# Altium project UNIREL-POT.PrjPcb
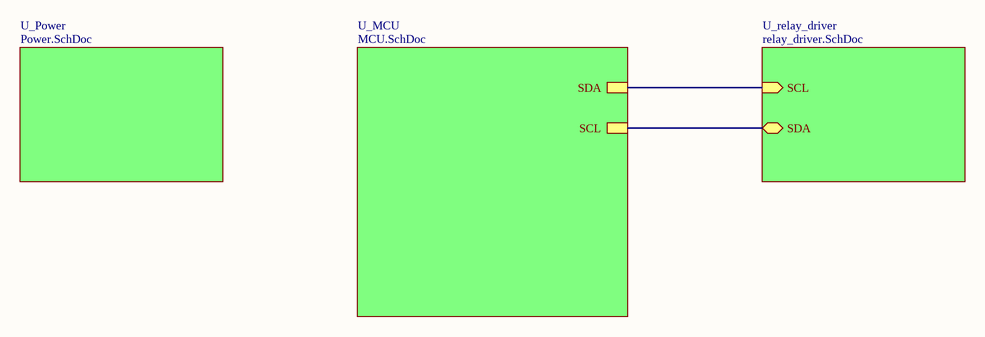
[diagram p0: overview.SchDoc]
5 sheets, 326 parts. Net scope: hierarchical (ports join the sheet entries above them; power ports are global).
Board files: PCB1.PcbDoc, PCB2.PcbDoc, PCB3.PcbDoc
Sheets:
  overview.SchDoc
    U_MCU = MCU.SchDoc
    U_Power = Power.SchDoc
    U_relay_driver = relay_driver.SchDoc
      U_relay_ladder = relay_ladder.SchDoc
      U_relay_ladder = relay_ladder.SchDoc
      U_relay_ladder = relay_ladder.SchDoc
      U_relay_ladder = relay_ladder.SchDoc
      U_relay_ladder = relay_ladder.SchDoc
      U_relay_ladder = relay_ladder.SchDoc
      U_relay_ladder = relay_ladder.SchDoc
      U_relay_ladder = relay_ladder.SchDoc
      U_relay_ladder = relay_ladder.SchDoc
      U_relay_ladder = relay_ladder.SchDoc

## Sheet overview.SchDoc
size A4

### Sub-sheets
U_MCU = MCU.SchDoc: SDA, SCL
U_Power = Power.SchDoc: no entries
U_relay_driver = relay_driver.SchDoc: SCL (in), SDA (bidir)

### Nets
SCL_DRV: sheet U_MCU/SDA, sheet U_relay_driver/SCL
SDA_DRV: sheet U_MCU/SCL, sheet U_relay_driver/SDA

## Sheet MCU.SchDoc
size A4
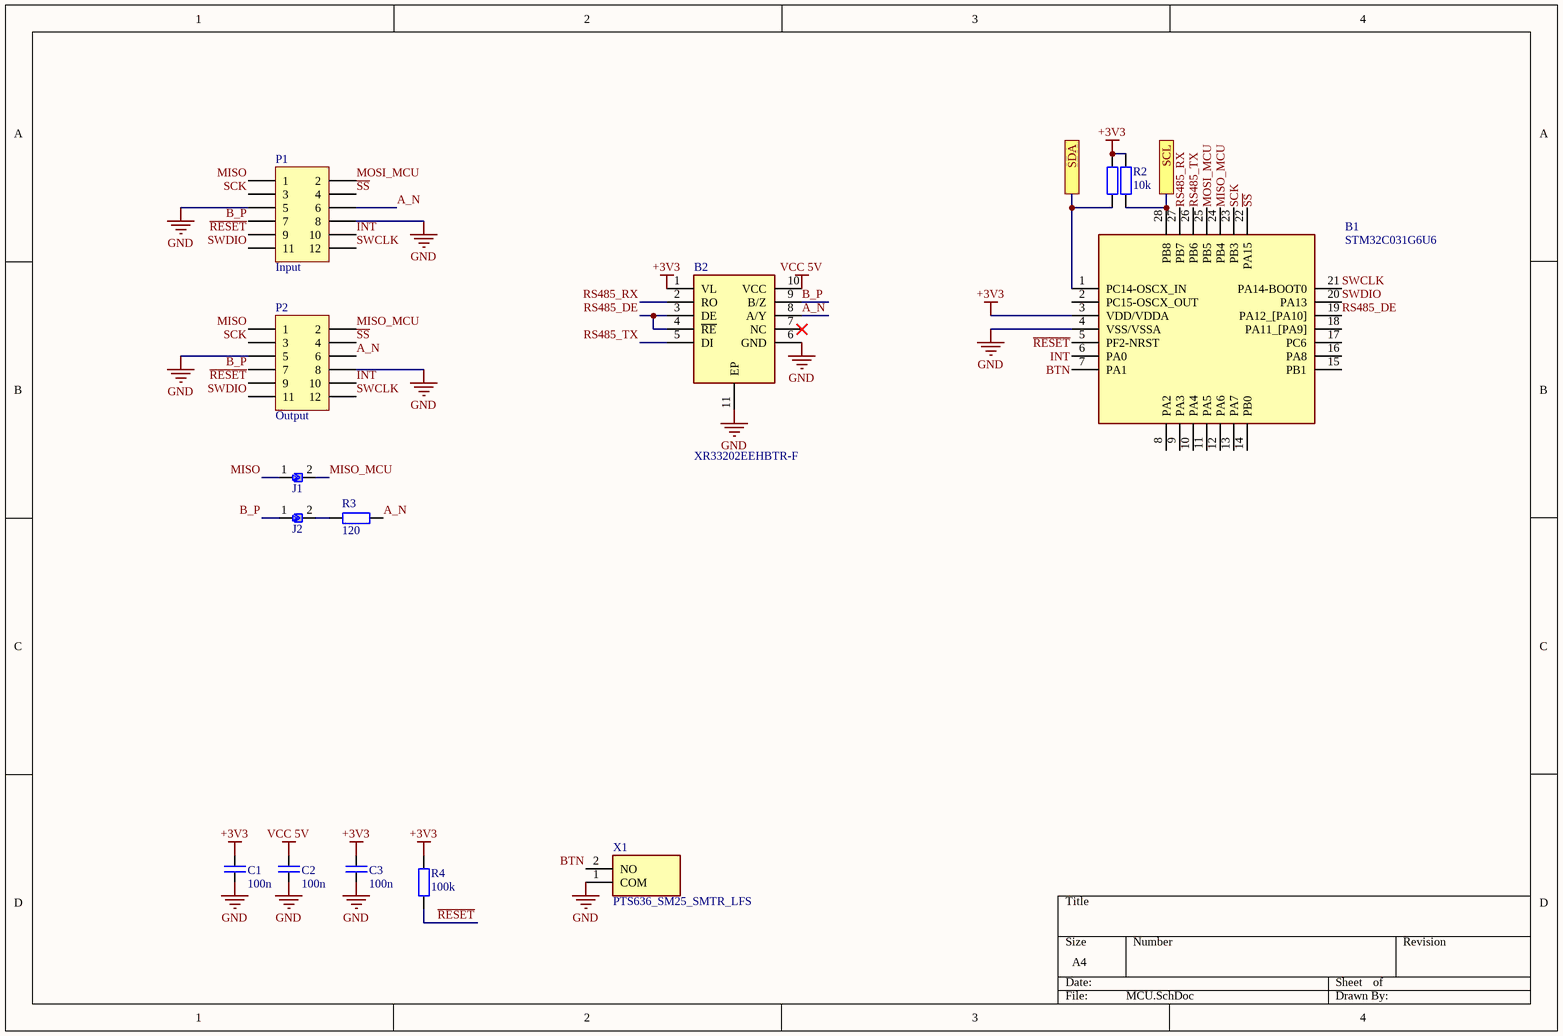
[diagram p1: MCU.SchDoc]

### Parts
B1  STM32C031G6U6  [QFN50P400X400X60-28N-D]
B2  XR33202EEHBTR-F  [SON50P300X300X80-11N-D]
C1  100n  [R1005_0402i_L]
C2  100n  [R1005_0402i_L]
C3  100n  [R1005_0402i_L]
J1  solder_jumper  [solder_jumper_triangle]  (value not drawn)
J2  solder_jumper  [solder_jumper_triangle]  (value not drawn)
P1  Input  [1.27mm SMD conn]
P2  Output  [1.27mm SMD conn]
R1  10k  [R1005_0402i_L]  (value not drawn)
R2  10k  [R1005_0402i_L]
R3  120  [R1005_0402i_L]
R4  100k  [R1005_0402i_L]
X1  PTS636_SM25_SMTR_LFS  [PTS636SM25SMTRLFS]

### Ports
SCL, SDA

### Nets
+3V3: B1.3(VDD/VDDA) B2.1(VL) C1.1 C3.1 R1.1 R2.1 R4.1
GND: B1.4(VSS/VSSA) B2.6(GND) B2.11(EP) C1.2 C2.2 C3.2 P1.5 P1.8 P2.5 P2.8 X1.1(COM)
VCC 5V: B2.10(VCC) C2.1
A_N: B2.8(A/Y) P1.6 P2.6 R3.2
B_P: B2.9(B/Z) J2.1 P1.7 P2.7
BTN: B1.7(PA1) X1.2(NO)
INT: B1.6(PA0) P1.10 P2.10
MISO: J1.1 P1.1 P2.1
MISO_MCU: B1.24(PB4) J1.2 P2.2
MOSI_MCU: B1.25(PB5) P1.2
~{RESET}: B1.5(PF2-NRST) P1.9 P2.9 R4.2
RS485_DE: B1.19(PA12_[PA10]) B2.3(DE) B2.4(~{RE})
RS485_RX: B1.27(PB7) B2.2(RO)
RS485_TX: B1.26(PB6) B2.5(DI)
~{SS}: B1.22(PA15) P1.4 P2.4
SCK: B1.23(PB3) P1.3 P2.3
SCL_DRV: B1.1(PC14-OSCX_IN) R1.2 ; port SDA
SDA_DRV: B1.28(PB8) R2.2 ; port SCL
SWCLK: B1.21(PA14-BOOT0) P1.12 P2.12
SWDIO: B1.20(PA13) P1.11 P2.11
NetJ2_2: J2.2 R3.1

Not connected (* = marked no-connect by the designer): B1 2(PC15-OSCX_OUT) 8(PA2) 9(PA3) 10(PA4) 11(PA5) 12(PA6) 13(PA7) 14(PB0) 15(PB1) 16(PA8) 17(PC6) 18(PA11_[PA9]); B2 7(NC)*

### Library data of the parts
B1 = STM32C031G6U6: Mainstream Arm Cortex-M0+ MCU with 32 Kbytes of Flash memory, 12 Kbytes RAM, 48 MHz CPU, 2x USART, timers, ADC, comm. I/F, 2-3.6V; Manufacturer_Name: STMicroelectronics; Geometry.Height: 0.6mm; Mouser Part Number: 511-STM32C031G6U6; Mouser Price/Stock: https://www.mouser.co.uk/ProductDetail/STMicroelectronics/STM32C031G6U6?qs=IPgv5n7u5QZqRf3nOTChhw%3D%3D; Manufacturer_Part_Number: STM32C031G6U6; Datasheet Link: https://www.st.com/resource/en/datasheet/stm32c031c4.pdf
B2 = XR33202EEHBTR-F: RS-422/RS-485 Interface IC Wide Supply Trans with I/O Interface; Manufacturer_Name: MaxLinear, Inc.; Geometry.Height: 0.8mm; Mouser Part Number: 701-XR33202EEHBTR-F; Mouser Price/Stock: https://www.mouser.co.uk/ProductDetail/MaxLinear/XR33202EEHBTR-F?qs=GtWAI9k6EVi4nRW8bj1LFw%3D%3D; Manufacturer_Part_Number: XR33202EEHBTR-F; Datasheet Link: https://www.maxlinear.com/ds/xr33202.pdf
C1-C3 = C: Capacitor
P1 P2 = Header 6X2: Header, 6-Pin, Dual row; LatestRevisionDate: 17-Jul-2002; LatestRevisionNote: Re-released for DXP Platform.; Publisher: Altium Limited
R1-R4 = R
X1 = PTS636_SM25_SMTR_LFS: Tactile Switches Tact 50mA 12VDC, 6.0x3.5, 2.5mm H, 180gf, G leads, No ground pin, White Actuator; Manufacturer_Name: C & K COMPONENTS; Manufacturer_Part_Number: PTS636 SM25 SMTR LFS; Geometry.Height: 2.7mm; Mouser Part Number: 611-PTS636SM25SMTRLF; Mouser Price/Stock: https://www.mouser.co.uk/ProductDetail/CK/PTS636-SM25-SMTR-LFS?qs=vLWxofP3U2yIXR4iooxesw%3D%3D; Datasheet Link: https://componentsearchengine.com/Datasheets/1/PTS636 SM25 SMTR LFS.pdf

## Sheet Power.SchDoc
size A4
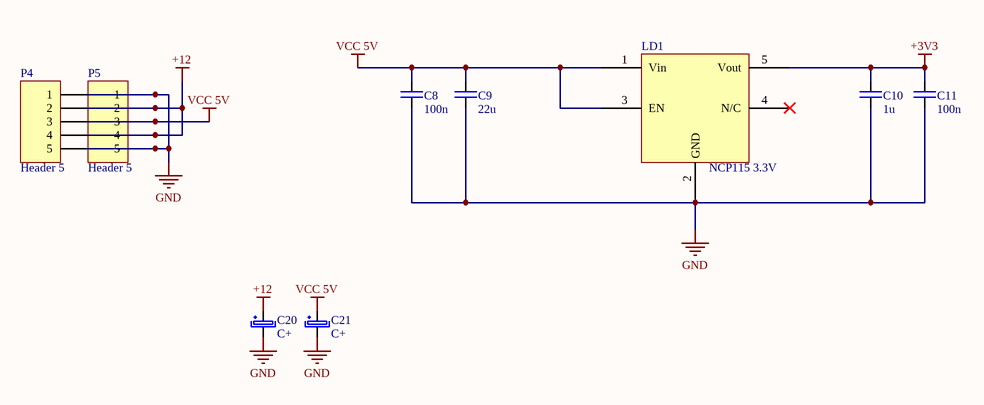
[diagram p2: Power.SchDoc]

### Parts
C8  100n  [R1005_0402i_L]
C9  22u  [C1608_0603I_L]
C10  1u  [R1005_0402i_L]
C11  100n  [R1005_0402i_L]
C20  C+  [C AlElko 5x11 R2]
C21  C+  [C AlElko 5x11 R2]
LD1  NCP115 3.3V  [TSOP95P280X110-6L]
P4  Header 5  [HDR1X5]
P5  Header 5  [HDR1X5]

### Nets
+3V3: C10.1 C11.1 LD1.5(Vout)
+12: C20.1 P4.2 P4.4 P5.2 P5.4
GND: C8.2 C9.2 C10.2 C11.2 C20.2 C21.2 LD1.2(GND) P4.1 P4.5 P5.1 P5.5
VCC 5V: C8.1 C9.1 C21.1 LD1.1(Vin) LD1.3(EN) P4.3 P5.3

Not connected (* = marked no-connect by the designer): LD1 4(N/C)*

### Library data of the parts
C8-C11 = C: Capacitor
C20 C21 = C+: Capacitor Polarized
P4 P5 = Header 5: Header, 5-Pin; LatestRevisionDate: 17-Jul-2002; LatestRevisionNote: Re-released for DXP Platform.; Publisher: Altium Limited

## Sheet relay_driver.SchDoc
size A2
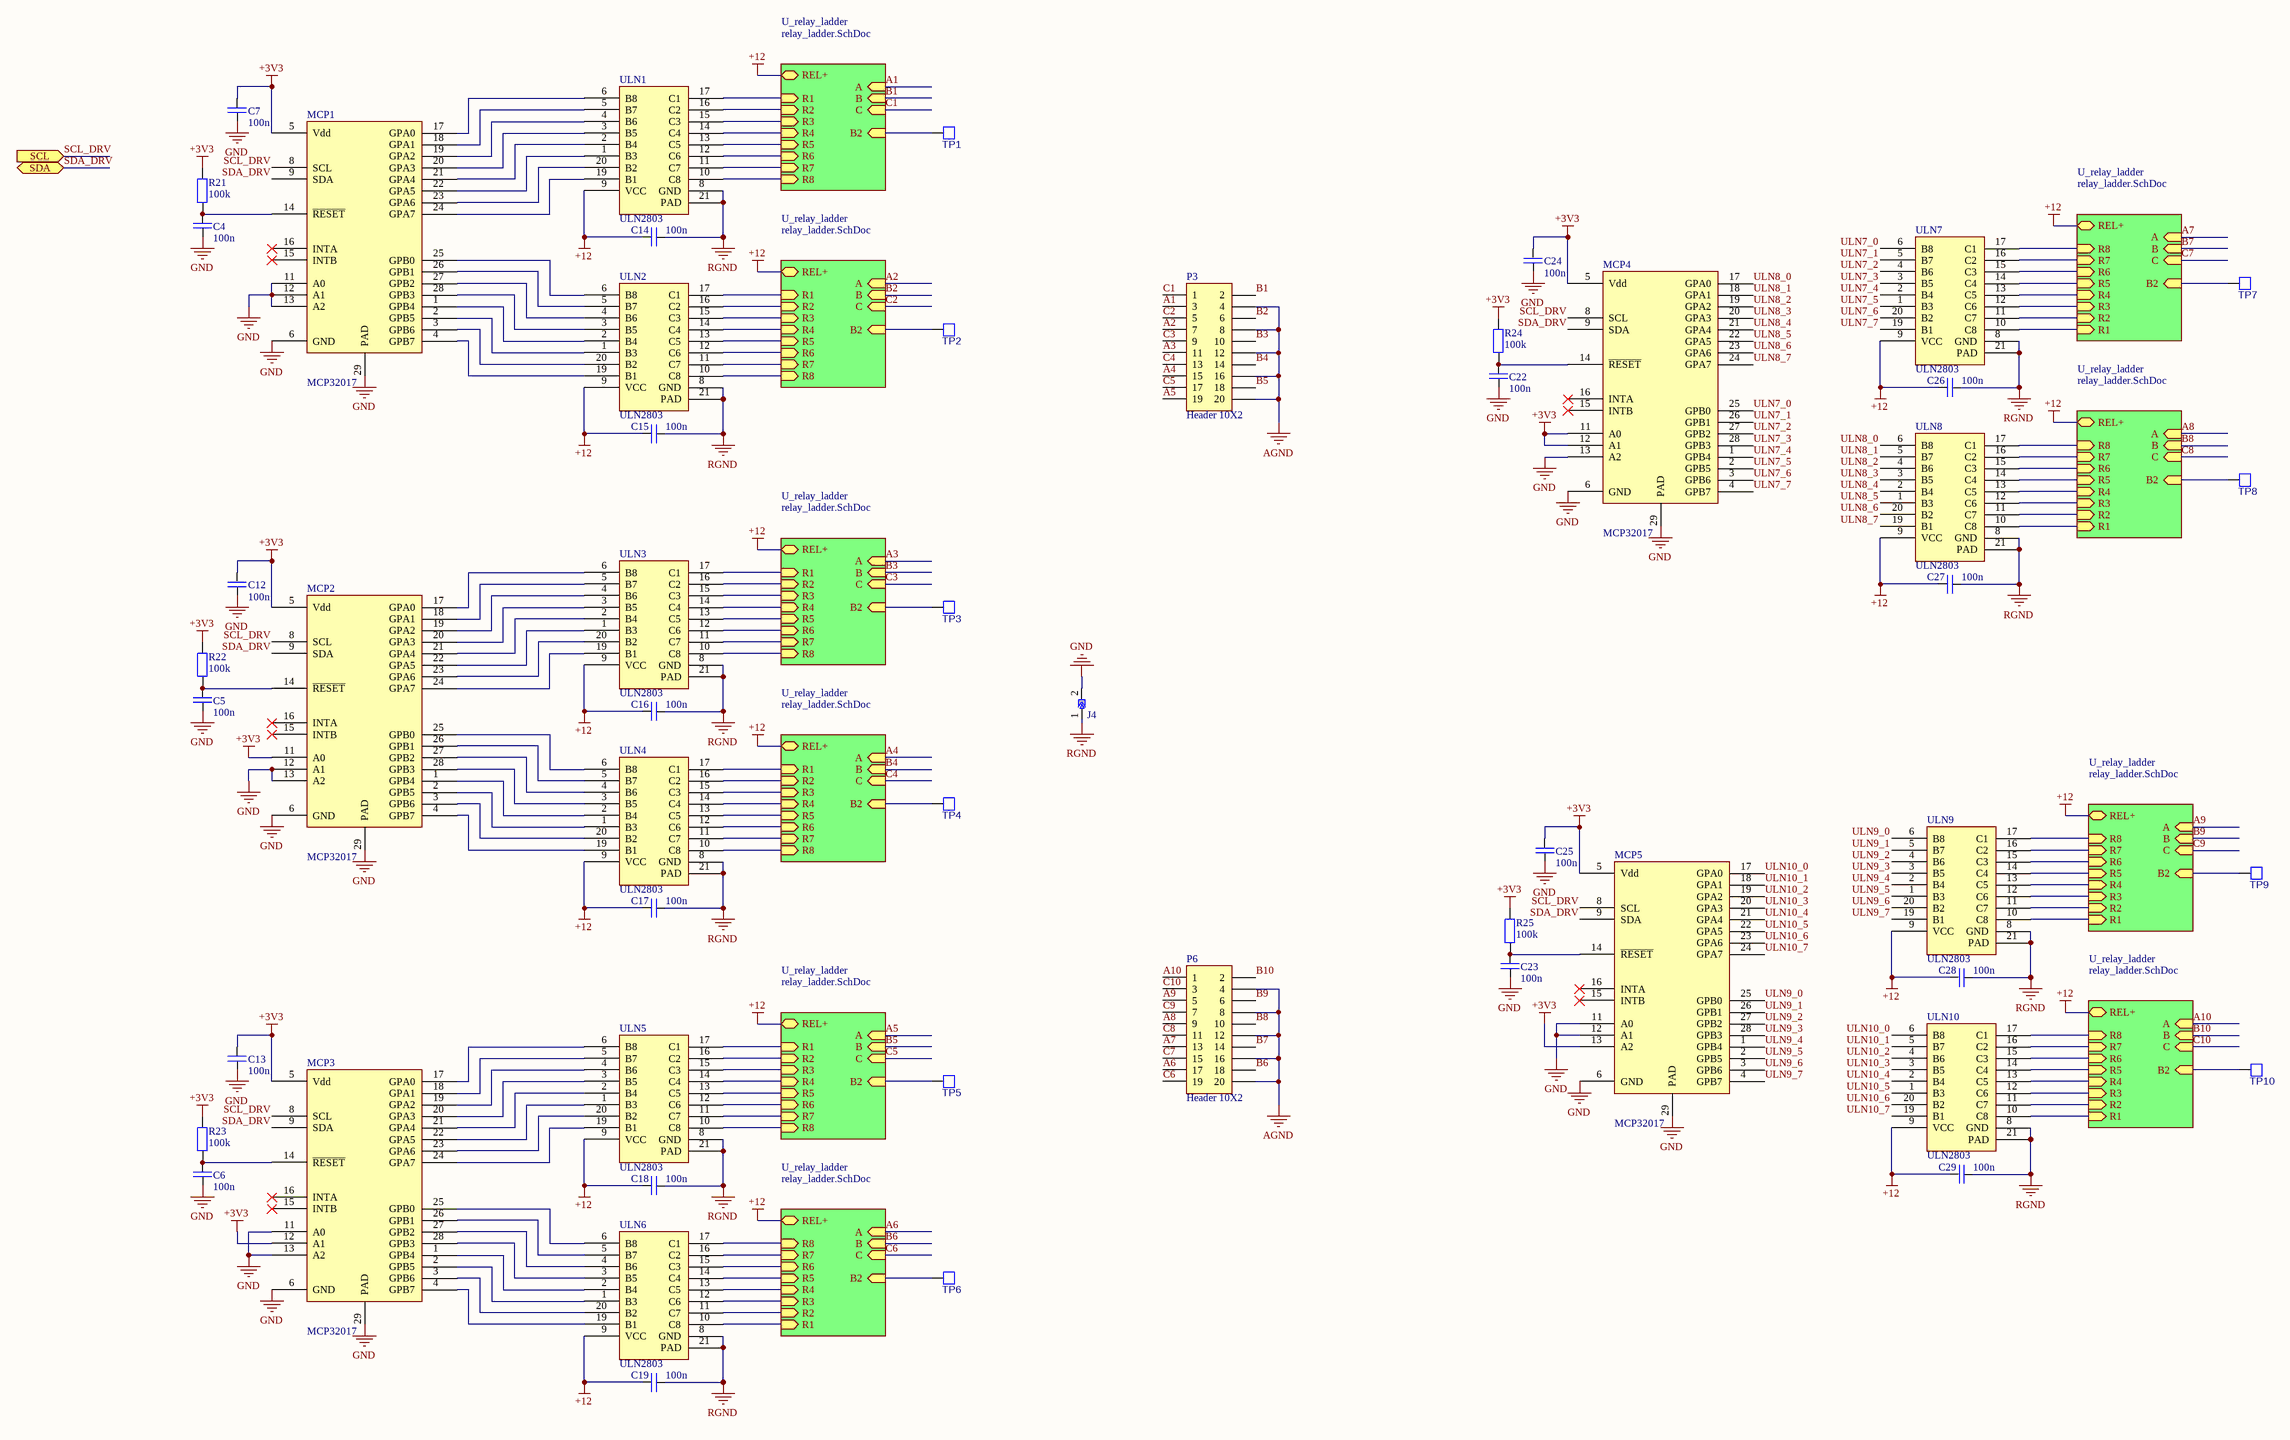
[diagram p3: relay_driver.SchDoc]

### Parts
C4  100n  [R1005_0402i_L]
C5  100n  [R1005_0402i_L]
C6  100n  [R1005_0402i_L]
C7  100n  [R1005_0402i_L]
C12  100n  [R1005_0402i_L]
C13  100n  [R1005_0402i_L]
C14  100n  [R1005_0402i_L]
C15  100n  [R1005_0402i_L]
C16  100n  [R1005_0402i_L]
C17  100n  [R1005_0402i_L]
C18  100n  [R1005_0402i_L]
C19  100n  [R1005_0402i_L]
C22  100n  [R1005_0402i_L]
C23  100n  [R1005_0402i_L]
C24  100n  [R1005_0402i_L]
C25  100n  [R1005_0402i_L]
C26  100n  [R1005_0402i_L]
C27  100n  [R1005_0402i_L]
C28  100n  [R1005_0402i_L]
C29  100n  [R1005_0402i_L]
J4  solder_jumper  [solder_jumper_triangle]  (value not drawn)
MCP1  MCP32017  [MCP23017 QFN]
MCP2  MCP32017  [MCP23017 QFN]
MCP3  MCP32017  [MCP23017 QFN]
MCP4  MCP32017  [MCP23017 QFN]
MCP5  MCP32017  [MCP23017 QFN]
P3  Header 10X2  [HDR2X10]
P6  Header 10X2  [HDR2X10]
R21  100k  [R1005_0402i_L]
R22  100k  [R1005_0402i_L]
R23  100k  [R1005_0402i_L]
R24  100k  [R1005_0402i_L]
R25  100k  [R1005_0402i_L]
TP1  PAD  [PAD_CIRC_HOLE]  (value not drawn)
TP2  PAD  [PAD_CIRC_HOLE]  (value not drawn)
TP3  PAD  [PAD_CIRC_HOLE]  (value not drawn)
TP4  PAD  [PAD_CIRC_HOLE]  (value not drawn)
TP5  PAD  [PAD_CIRC_HOLE]  (value not drawn)
TP6  PAD  [PAD_CIRC_HOLE]  (value not drawn)
TP7  PAD  [PAD_CIRC_HOLE]  (value not drawn)
TP8  PAD  [PAD_CIRC_HOLE]  (value not drawn)
TP9  PAD  [PAD_CIRC_HOLE]  (value not drawn)
TP10  PAD  [PAD_CIRC_HOLE]  (value not drawn)
ULN1  ULN2803  [QFN127P600-8N]
ULN2  ULN2803  [QFN127P600-8N]
ULN3  ULN2803  [QFN127P600-8N]
ULN4  ULN2803  [QFN127P600-8N]
ULN5  ULN2803  [QFN127P600-8N]
ULN6  ULN2803  [QFN127P600-8N]
ULN7  ULN2803  [QFN127P600-8N]
ULN8  ULN2803  [QFN127P600-8N]
ULN9  ULN2803  [QFN127P600-8N]
ULN10  ULN2803  [QFN127P600-8N]

### Sub-sheets
U_relay_ladder = relay_ladder.SchDoc: B (in), C (in), A (in), REL+ (bidir), R1 (in), R2 (in), R3 (in), R4 (in), R5 (in), R6 (in), R7 (in), R8 (in), B2 (in)
U_relay_ladder = relay_ladder.SchDoc: B (in), C (in), A (in), REL+ (bidir), R1 (in), R2 (in), R3 (in), R4 (in), R5 (in), R6 (in), R7 (in), R8 (in), B2 (in)
U_relay_ladder = relay_ladder.SchDoc: B (in), C (in), A (in), REL+ (bidir), R1 (in), R2 (in), R3 (in), R4 (in), R5 (in), R6 (in), R7 (in), R8 (in), B2 (in)
U_relay_ladder = relay_ladder.SchDoc: B (in), C (in), A (in), REL+ (bidir), R1 (in), R2 (in), R3 (in), R4 (in), R5 (in), R6 (in), R7 (in), R8 (in), B2 (in)
U_relay_ladder = relay_ladder.SchDoc: B (in), C (in), A (in), REL+ (bidir), R1 (in), R2 (in), R3 (in), R4 (in), R5 (in), R6 (in), R7 (in), R8 (in), B2 (in)
U_relay_ladder = relay_ladder.SchDoc: B (in), C (in), A (in), REL+ (bidir), R1 (in), R2 (in), R3 (in), R4 (in), R5 (in), R6 (in), R7 (in), R8 (in), B2 (in)
U_relay_ladder = relay_ladder.SchDoc: B (in), C (in), A (in), REL+ (bidir), R1 (in), R2 (in), R3 (in), R4 (in), R5 (in), R6 (in), R7 (in), R8 (in), B2 (in)
U_relay_ladder = relay_ladder.SchDoc: B (in), C (in), A (in), REL+ (bidir), R1 (in), R2 (in), R3 (in), R4 (in), R5 (in), R6 (in), R7 (in), R8 (in), B2 (in)
U_relay_ladder = relay_ladder.SchDoc: B (in), C (in), A (in), REL+ (bidir), R1 (in), R2 (in), R3 (in), R4 (in), R5 (in), R6 (in), R7 (in), R8 (in), B2 (in)
U_relay_ladder = relay_ladder.SchDoc: B (in), C (in), A (in), REL+ (bidir), R1 (in), R2 (in), R3 (in), R4 (in), R5 (in), R6 (in), R7 (in), R8 (in), B2 (in)

### Ports
SCL (in), SDA (bidir)

### Nets
+3V3: C7.2 C12.2 C13.2 C24.2 C25.2 MCP1.5(Vdd) MCP2.5(Vdd) MCP2.11(A0) MCP3.5(Vdd) MCP3.12(A1) MCP4.5(Vdd) MCP4.11(A0) MCP4.12(A1) MCP5.5(Vdd) MCP5.13(A2) R21.1 R22.1 R23.1 R24.1 R25.1
+12: C14.1 C15.1 C16.1 C17.1 C18.1 C19.1 C26.1 C27.1 C28.1 C29.1 ULN1.9(VCC) ULN2.9(VCC) ULN3.9(VCC) ULN4.9(VCC) ULN5.9(VCC) ULN6.9(VCC) ULN7.9(VCC) ULN8.9(VCC) ULN9.9(VCC) ULN10.9(VCC) ; sheet U_relay_ladder/REL+, sheet U_relay_ladder/REL+, sheet U_relay_ladder/REL+, sheet U_relay_ladder/REL+, sheet U_relay_ladder/REL+, sheet U_relay_ladder/REL+, sheet U_relay_ladder/REL+, sheet U_relay_ladder/REL+, sheet U_relay_ladder/REL+, sheet U_relay_ladder/REL+
AGND: P3.4 P3.8 P3.12 P3.16 P3.20 P6.4 P6.8 P6.12 P6.16 P6.20
GND: C4.1 C5.1 C6.1 C7.1 C12.1 C13.1 C22.1 C23.1 C24.1 C25.1 J4.2 MCP1.6(GND) MCP1.11(A0) MCP1.12(A1) MCP1.13(A2) MCP1.29(PAD) MCP2.6(GND) MCP2.12(A1) MCP2.13(A2) MCP2.29(PAD) MCP3.6(GND) MCP3.11(A0) MCP3.13(A2) MCP3.29(PAD) MCP4.6(GND) MCP4.13(A2) MCP4.29(PAD) MCP5.6(GND) MCP5.11(A0) MCP5.12(A1) MCP5.29(PAD)
RGND: C14.2 C15.2 C16.2 C17.2 C18.2 C19.2 C26.2 C27.2 C28.2 C29.2 J4.1 ULN1.8(GND) ULN1.21(PAD) ULN2.8(GND) ULN2.21(PAD) ULN3.8(GND) ULN3.21(PAD) ULN4.8(GND) ULN4.21(PAD) ULN5.8(GND) ULN5.21(PAD) ULN6.8(GND) ULN6.21(PAD) ULN7.8(GND) ULN7.21(PAD) ULN8.8(GND) ULN8.21(PAD) ULN9.8(GND) ULN9.21(PAD) ULN10.8(GND) ULN10.21(PAD)
A1: P3.3 ; sheet U_relay_ladder/A
A2: P3.7 ; sheet U_relay_ladder/A
A3: P3.11 ; sheet U_relay_ladder/A
A4: P3.15 ; sheet U_relay_ladder/A
A5: P3.19 ; sheet U_relay_ladder/A
A6: P6.17 ; sheet U_relay_ladder/A
A7: P6.13 ; sheet U_relay_ladder/A
A8: P6.9 ; sheet U_relay_ladder/A
A9: P6.5 ; sheet U_relay_ladder/A
A10: P6.1 ; sheet U_relay_ladder/A
B1: P3.2 TP1.1 ; sheet U_relay_ladder/B, sheet U_relay_ladder/B2
B2: P3.6 TP2.1 ; sheet U_relay_ladder/B, sheet U_relay_ladder/B2
B3: P3.10 TP3.1 ; sheet U_relay_ladder/B, sheet U_relay_ladder/B2
B4: P3.14 TP4.1 ; sheet U_relay_ladder/B, sheet U_relay_ladder/B2
B5: P3.18 TP5.1 ; sheet U_relay_ladder/B, sheet U_relay_ladder/B2
B6: P6.18 TP6.1 ; sheet U_relay_ladder/B, sheet U_relay_ladder/B2
B7: P6.14 TP7.1 ; sheet U_relay_ladder/B, sheet U_relay_ladder/B2
B8: P6.10 TP8.1 ; sheet U_relay_ladder/B, sheet U_relay_ladder/B2
B9: P6.6 TP9.1 ; sheet U_relay_ladder/B, sheet U_relay_ladder/B2
B10: P6.2 TP10.1 ; sheet U_relay_ladder/B, sheet U_relay_ladder/B2
C1: P3.1 ; sheet U_relay_ladder/C
C2: P3.5 ; sheet U_relay_ladder/C
C3: P3.9 ; sheet U_relay_ladder/C
C4: P3.13 ; sheet U_relay_ladder/C
C5: P3.17 ; sheet U_relay_ladder/C
C6: P6.19 ; sheet U_relay_ladder/C
C7: P6.15 ; sheet U_relay_ladder/C
C8: P6.11 ; sheet U_relay_ladder/C
C9: P6.7 ; sheet U_relay_ladder/C
C10: P6.3 ; sheet U_relay_ladder/C
SCL_DRV: MCP1.8(SCL) MCP2.8(SCL) MCP3.8(SCL) MCP4.8(SCL) MCP5.8(SCL) ; port SCL
SDA_DRV: MCP1.9(SDA) MCP2.9(SDA) MCP3.9(SDA) MCP4.9(SDA) MCP5.9(SDA) ; port SDA
ULN7_0: MCP4.25(GPB0) ULN7.6(B8)
ULN7_1: MCP4.26(GPB1) ULN7.5(B7)
ULN7_2: MCP4.27(GPB2) ULN7.4(B6)
ULN7_3: MCP4.28(GPB3) ULN7.3(B5)
ULN7_4: MCP4.1(GPB4) ULN7.2(B4)
ULN7_5: MCP4.2(GPB5) ULN7.1(B3)
ULN7_6: MCP4.3(GPB6) ULN7.20(B2)
ULN7_7: MCP4.4(GPB7) ULN7.19(B1)
ULN8_0: MCP4.17(GPA0) ULN8.6(B8)
ULN8_1: MCP4.18(GPA1) ULN8.5(B7)
ULN8_2: MCP4.19(GPA2) ULN8.4(B6)
ULN8_3: MCP4.20(GPA3) ULN8.3(B5)
ULN8_4: MCP4.21(GPA4) ULN8.2(B4)
ULN8_5: MCP4.22(GPA5) ULN8.1(B3)
ULN8_6: MCP4.23(GPA6) ULN8.20(B2)
ULN8_7: MCP4.24(GPA7) ULN8.19(B1)
ULN9_0: MCP5.25(GPB0) ULN9.6(B8)
ULN9_1: MCP5.26(GPB1) ULN9.5(B7)
ULN9_2: MCP5.27(GPB2) ULN9.4(B6)
ULN9_3: MCP5.28(GPB3) ULN9.3(B5)
ULN9_4: MCP5.1(GPB4) ULN9.2(B4)
ULN9_5: MCP5.2(GPB5) ULN9.1(B3)
ULN9_6: MCP5.3(GPB6) ULN9.20(B2)
ULN9_7: MCP5.4(GPB7) ULN9.19(B1)
ULN10_0: MCP5.17(GPA0) ULN10.6(B8)
ULN10_1: MCP5.18(GPA1) ULN10.5(B7)
ULN10_2: MCP5.19(GPA2) ULN10.4(B6)
ULN10_3: MCP5.20(GPA3) ULN10.3(B5)
ULN10_4: MCP5.21(GPA4) ULN10.2(B4)
ULN10_5: MCP5.22(GPA5) ULN10.1(B3)
ULN10_6: MCP5.23(GPA6) ULN10.20(B2)
ULN10_7: MCP5.24(GPA7) ULN10.19(B1)
NetC4_2: C4.2 MCP1.14(~{RESET}) R21.2
NetC5_2: C5.2 MCP2.14(~{RESET}) R22.2
NetC6_2: C6.2 MCP3.14(~{RESET}) R23.2
NetC22_2: C22.2 MCP4.14(~{RESET}) R24.2
NetC23_2: C23.2 MCP5.14(~{RESET}) R25.2
NetK1_U_relay_ladder1_8: ULN10.17(C1) ; sheet U_relay_ladder/R8
NetK1_U_relay_ladder2_8: ULN9.17(C1) ; sheet U_relay_ladder/R8
NetK1_U_relay_ladder3_8: ULN8.17(C1) ; sheet U_relay_ladder/R8
NetK1_U_relay_ladder4_8: ULN7.17(C1) ; sheet U_relay_ladder/R8
NetK1_U_relay_ladder5_8: ULN6.17(C1) ; sheet U_relay_ladder/R8
NetK1_U_relay_ladder6_8: ULN5.10(C8) ; sheet U_relay_ladder/R8
NetK1_U_relay_ladder7_8: ULN4.10(C8) ; sheet U_relay_ladder/R8
NetK1_U_relay_ladder8_8: ULN3.10(C8) ; sheet U_relay_ladder/R8
NetK1_U_relay_ladder9_8: ULN2.10(C8) ; sheet U_relay_ladder/R8
NetK1_U_relay_ladder10_8: ULN1.10(C8) ; sheet U_relay_ladder/R8
NetK2_U_relay_ladder1_8: ULN10.16(C2) ; sheet U_relay_ladder/R7
NetK2_U_relay_ladder2_8: ULN9.16(C2) ; sheet U_relay_ladder/R7
NetK2_U_relay_ladder3_8: ULN8.16(C2) ; sheet U_relay_ladder/R7
NetK2_U_relay_ladder4_8: ULN7.16(C2) ; sheet U_relay_ladder/R7
NetK2_U_relay_ladder5_8: ULN6.16(C2) ; sheet U_relay_ladder/R7
NetK2_U_relay_ladder6_8: ULN5.11(C7) ; sheet U_relay_ladder/R7
NetK2_U_relay_ladder7_8: ULN4.11(C7) ; sheet U_relay_ladder/R7
NetK2_U_relay_ladder8_8: ULN3.11(C7) ; sheet U_relay_ladder/R7
NetK2_U_relay_ladder9_8: ULN2.11(C7) ; sheet U_relay_ladder/R7
NetK2_U_relay_ladder10_8: ULN1.11(C7) ; sheet U_relay_ladder/R7
NetK3_U_relay_ladder1_8: ULN10.15(C3) ; sheet U_relay_ladder/R6
NetK3_U_relay_ladder2_8: ULN9.15(C3) ; sheet U_relay_ladder/R6
NetK3_U_relay_ladder3_8: ULN8.15(C3) ; sheet U_relay_ladder/R6
NetK3_U_relay_ladder4_8: ULN7.15(C3) ; sheet U_relay_ladder/R6
NetK3_U_relay_ladder5_8: ULN6.15(C3) ; sheet U_relay_ladder/R6
NetK3_U_relay_ladder6_8: ULN5.12(C6) ; sheet U_relay_ladder/R6
NetK3_U_relay_ladder7_8: ULN4.12(C6) ; sheet U_relay_ladder/R6
NetK3_U_relay_ladder8_8: ULN3.12(C6) ; sheet U_relay_ladder/R6
NetK3_U_relay_ladder9_8: ULN2.12(C6) ; sheet U_relay_ladder/R6
NetK3_U_relay_ladder10_8: ULN1.12(C6) ; sheet U_relay_ladder/R6
NetK4_U_relay_ladder1_8: ULN10.14(C4) ; sheet U_relay_ladder/R5
NetK4_U_relay_ladder2_8: ULN9.14(C4) ; sheet U_relay_ladder/R5
NetK4_U_relay_ladder3_8: ULN8.14(C4) ; sheet U_relay_ladder/R5
NetK4_U_relay_ladder4_8: ULN7.14(C4) ; sheet U_relay_ladder/R5
NetK4_U_relay_ladder5_8: ULN6.14(C4) ; sheet U_relay_ladder/R5
NetK4_U_relay_ladder6_8: ULN5.13(C5) ; sheet U_relay_ladder/R5
NetK4_U_relay_ladder7_8: ULN4.13(C5) ; sheet U_relay_ladder/R5
NetK4_U_relay_ladder8_8: ULN3.13(C5) ; sheet U_relay_ladder/R5
NetK4_U_relay_ladder9_8: ULN2.13(C5) ; sheet U_relay_ladder/R5
NetK4_U_relay_ladder10_8: ULN1.13(C5) ; sheet U_relay_ladder/R5
NetK5_U_relay_ladder1_8: ULN10.13(C5) ; sheet U_relay_ladder/R4
NetK5_U_relay_ladder2_8: ULN9.13(C5) ; sheet U_relay_ladder/R4
NetK5_U_relay_ladder3_8: ULN8.13(C5) ; sheet U_relay_ladder/R4
NetK5_U_relay_ladder4_8: ULN7.13(C5) ; sheet U_relay_ladder/R4
NetK5_U_relay_ladder5_8: ULN6.13(C5) ; sheet U_relay_ladder/R4
NetK5_U_relay_ladder6_8: ULN5.14(C4) ; sheet U_relay_ladder/R4
NetK5_U_relay_ladder7_8: ULN4.14(C4) ; sheet U_relay_ladder/R4
NetK5_U_relay_ladder8_8: ULN3.14(C4) ; sheet U_relay_ladder/R4
NetK5_U_relay_ladder9_8: ULN2.14(C4) ; sheet U_relay_ladder/R4
NetK5_U_relay_ladder10_8: ULN1.14(C4) ; sheet U_relay_ladder/R4
NetK6_U_relay_ladder1_8: ULN10.12(C6) ; sheet U_relay_ladder/R3
NetK6_U_relay_ladder2_8: ULN9.12(C6) ; sheet U_relay_ladder/R3
NetK6_U_relay_ladder3_8: ULN8.12(C6) ; sheet U_relay_ladder/R3
NetK6_U_relay_ladder4_8: ULN7.12(C6) ; sheet U_relay_ladder/R3
NetK6_U_relay_ladder5_8: ULN6.12(C6) ; sheet U_relay_ladder/R3
NetK6_U_relay_ladder6_8: ULN5.15(C3) ; sheet U_relay_ladder/R3
NetK6_U_relay_ladder7_8: ULN4.15(C3) ; sheet U_relay_ladder/R3
NetK6_U_relay_ladder8_8: ULN3.15(C3) ; sheet U_relay_ladder/R3
NetK6_U_relay_ladder9_8: ULN2.15(C3) ; sheet U_relay_ladder/R3
NetK6_U_relay_ladder10_8: ULN1.15(C3) ; sheet U_relay_ladder/R3
NetK7_U_relay_ladder1_8: ULN10.11(C7) ; sheet U_relay_ladder/R2
NetK7_U_relay_ladder2_8: ULN9.11(C7) ; sheet U_relay_ladder/R2
NetK7_U_relay_ladder3_8: ULN8.11(C7) ; sheet U_relay_ladder/R2
NetK7_U_relay_ladder4_8: ULN7.11(C7) ; sheet U_relay_ladder/R2
NetK7_U_relay_ladder5_8: ULN6.11(C7) ; sheet U_relay_ladder/R2
NetK7_U_relay_ladder6_8: ULN5.16(C2) ; sheet U_relay_ladder/R2
NetK7_U_relay_ladder7_8: ULN4.16(C2) ; sheet U_relay_ladder/R2
NetK7_U_relay_ladder8_8: ULN3.16(C2) ; sheet U_relay_ladder/R2
NetK7_U_relay_ladder9_8: ULN2.16(C2) ; sheet U_relay_ladder/R2
NetK7_U_relay_ladder10_8: ULN1.16(C2) ; sheet U_relay_ladder/R2
NetK8_U_relay_ladder1_8: ULN10.10(C8) ; sheet U_relay_ladder/R1
NetK8_U_relay_ladder2_8: ULN9.10(C8) ; sheet U_relay_ladder/R1
NetK8_U_relay_ladder3_8: ULN8.10(C8) ; sheet U_relay_ladder/R1
NetK8_U_relay_ladder4_8: ULN7.10(C8) ; sheet U_relay_ladder/R1
NetK8_U_relay_ladder5_8: ULN6.10(C8) ; sheet U_relay_ladder/R1
NetK8_U_relay_ladder6_8: ULN5.17(C1) ; sheet U_relay_ladder/R1
NetK8_U_relay_ladder7_8: ULN4.17(C1) ; sheet U_relay_ladder/R1
NetK8_U_relay_ladder8_8: ULN3.17(C1) ; sheet U_relay_ladder/R1
NetK8_U_relay_ladder9_8: ULN2.17(C1) ; sheet U_relay_ladder/R1
NetK8_U_relay_ladder10_8: ULN1.17(C1) ; sheet U_relay_ladder/R1
NetMCP1_1: MCP1.1(GPB4) ULN2.2(B4)
NetMCP1_2: MCP1.2(GPB5) ULN2.1(B3)
NetMCP1_3: MCP1.3(GPB6) ULN2.20(B2)
NetMCP1_4: MCP1.4(GPB7) ULN2.19(B1)
NetMCP1_17: MCP1.17(GPA0) ULN1.6(B8)
NetMCP1_18: MCP1.18(GPA1) ULN1.5(B7)
NetMCP1_19: MCP1.19(GPA2) ULN1.4(B6)
NetMCP1_20: MCP1.20(GPA3) ULN1.3(B5)
NetMCP1_21: MCP1.21(GPA4) ULN1.2(B4)
NetMCP1_22: MCP1.22(GPA5) ULN1.1(B3)
NetMCP1_23: MCP1.23(GPA6) ULN1.20(B2)
NetMCP1_24: MCP1.24(GPA7) ULN1.19(B1)
NetMCP1_25: MCP1.25(GPB0) ULN2.6(B8)
NetMCP1_26: MCP1.26(GPB1) ULN2.5(B7)
NetMCP1_27: MCP1.27(GPB2) ULN2.4(B6)
NetMCP1_28: MCP1.28(GPB3) ULN2.3(B5)
NetMCP2_1: MCP2.1(GPB4) ULN4.2(B4)
NetMCP2_2: MCP2.2(GPB5) ULN4.1(B3)
NetMCP2_3: MCP2.3(GPB6) ULN4.20(B2)
NetMCP2_4: MCP2.4(GPB7) ULN4.19(B1)
NetMCP2_17: MCP2.17(GPA0) ULN3.6(B8)
NetMCP2_18: MCP2.18(GPA1) ULN3.5(B7)
NetMCP2_19: MCP2.19(GPA2) ULN3.4(B6)
NetMCP2_20: MCP2.20(GPA3) ULN3.3(B5)
NetMCP2_21: MCP2.21(GPA4) ULN3.2(B4)
NetMCP2_22: MCP2.22(GPA5) ULN3.1(B3)
NetMCP2_23: MCP2.23(GPA6) ULN3.20(B2)
NetMCP2_24: MCP2.24(GPA7) ULN3.19(B1)
NetMCP2_25: MCP2.25(GPB0) ULN4.6(B8)
NetMCP2_26: MCP2.26(GPB1) ULN4.5(B7)
NetMCP2_27: MCP2.27(GPB2) ULN4.4(B6)
NetMCP2_28: MCP2.28(GPB3) ULN4.3(B5)
NetMCP3_1: MCP3.1(GPB4) ULN6.2(B4)
NetMCP3_2: MCP3.2(GPB5) ULN6.1(B3)
NetMCP3_3: MCP3.3(GPB6) ULN6.20(B2)
NetMCP3_4: MCP3.4(GPB7) ULN6.19(B1)
NetMCP3_17: MCP3.17(GPA0) ULN5.6(B8)
NetMCP3_18: MCP3.18(GPA1) ULN5.5(B7)
NetMCP3_19: MCP3.19(GPA2) ULN5.4(B6)
NetMCP3_20: MCP3.20(GPA3) ULN5.3(B5)
NetMCP3_21: MCP3.21(GPA4) ULN5.2(B4)
NetMCP3_22: MCP3.22(GPA5) ULN5.1(B3)
NetMCP3_23: MCP3.23(GPA6) ULN5.20(B2)
NetMCP3_24: MCP3.24(GPA7) ULN5.19(B1)
NetMCP3_25: MCP3.25(GPB0) ULN6.6(B8)
NetMCP3_26: MCP3.26(GPB1) ULN6.5(B7)
NetMCP3_27: MCP3.27(GPB2) ULN6.4(B6)
NetMCP3_28: MCP3.28(GPB3) ULN6.3(B5)

Not connected (* = marked no-connect by the designer): MCP1 15(INTB)* 16(INTA)*; MCP2 15(INTB)* 16(INTA)*; MCP3 15(INTB)* 16(INTA)*; MCP4 15(INTB)* 16(INTA)*; MCP5 15(INTB)* 16(INTA)*

### Library data of the parts
C4-C7 C12-C19 C22-C29 = C: Capacitor
P3 P6 = Header 10X2: Header, 10-Pin, Dual row; LatestRevisionDate: 17-Jul-2002; LatestRevisionNote: Re-released for DXP Platform.; Publisher: Altium Limited
R21-R25 = R

## Sheet relay_ladder.SchDoc
size A4
Used 10 times, as channels U_relay_driver/U_relay_ladder, U_relay_driver/U_relay_ladder, U_relay_driver/U_relay_ladder, U_relay_driver/U_relay_ladder, U_relay_driver/U_relay_ladder, U_relay_driver/U_relay_ladder, U_relay_driver/U_relay_ladder, U_relay_driver/U_relay_ladder, U_relay_driver/U_relay_ladder, U_relay_driver/U_relay_ladder. Parts and nets are listed once, with the designators drawn on the sheet.
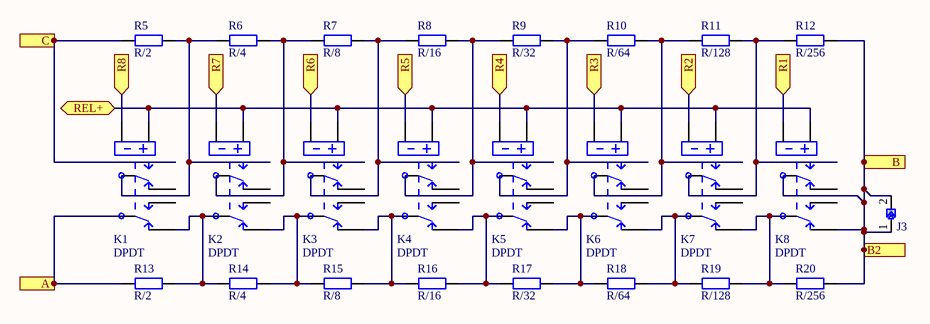
[diagram p4: relay_ladder.SchDoc]

### Parts
J3  solder_jumper  [SOLDER_JUMPER_SQUARE]  (value not drawn)
K1  DPDT  [AXICOM IM-G Relay]
K2  DPDT  [AXICOM IM-G Relay]
K3  DPDT  [AXICOM IM-G Relay]
K4  DPDT  [AXICOM IM-G Relay]
K5  DPDT  [AXICOM IM-G Relay]
K6  DPDT  [AXICOM IM-G Relay]
K7  DPDT  [AXICOM IM-G Relay]
K8  DPDT  [AXICOM IM-G Relay]
R5  R/2  [R2012_0805I_L]
R6  R/4  [R2012_0805I_L]
R7  R/8  [R2012_0805I_L]
R8  R/16  [R2012_0805I_L]
R9  R/32  [R2012_0805I_L]
R10  R/64  [R2012_0805I_L]
R11  R/128  [R2012_0805I_L]
R12  R/256  [R2012_0805I_L]
R13  R/2  [R2012_0805I_L]
R14  R/4  [R2012_0805I_L]
R15  R/8  [R2012_0805I_L]
R16  R/16  [R2012_0805I_L]
R17  R/32  [R2012_0805I_L]
R18  R/64  [R2012_0805I_L]
R19  R/128  [R2012_0805I_L]
R20  R/256  [R2012_0805I_L]

### Ports
A (in), B2 (in), B (in), C (in), R1 (in), R2 (in), R3 (in), R4 (in), R5 (in), R6 (in), R7 (in), R8 (in), REL+ (bidir)

### Nets
A: K1.6 R13.1 ; port A
B: J3.1 J3.2 K8.3 K8.7 R12.2 R20.2 ; port B, port B2
C: K1.4 R5.1 ; port C
R1: K8.8 ; port R1
R2: K7.8 ; port R2
R3: K6.8 ; port R3
R4: K5.8 ; port R4
R5: K4.8 ; port R5
R6: K3.8 ; port R6
R7: K2.8 ; port R7
R8: K1.8 ; port R8
REL+: K1.1 K2.1 K3.1 K4.1 K5.1 K6.1 K7.1 K8.1 ; port REL+
NetK1_3: K1.3 K2.4 R5.2 R6.1
NetK1_7: K1.7 K2.6 R13.2 R14.1
NetK2_3: K2.3 K3.4 R6.2 R7.1
NetK2_7: K2.7 K3.6 R14.2 R15.1
NetK3_3: K3.3 K4.4 R7.2 R8.1
NetK3_7: K3.7 K4.6 R15.2 R16.1
NetK4_3: K4.3 K5.4 R8.2 R9.1
NetK4_7: K4.7 K5.6 R16.2 R17.1
NetK5_3: K5.3 K6.4 R9.2 R10.1
NetK5_7: K5.7 K6.6 R17.2 R18.1
NetK6_3: K6.3 K7.4 R10.2 R11.1
NetK6_7: K6.7 K7.6 R18.2 R19.1
NetK7_3: K7.3 K8.4 R11.2 R12.1
NetK7_7: K7.7 K8.6 R19.2 R20.1

Not connected (* = marked no-connect by the designer): K1 2 5; K2 2 5; K3 2 5; K4 2 5; K5 2 5; K6 2 5; K7 2 5; K8 2 5

### Channels
U_relay_driver/U_relay_ladder: designators end in _U_relay_ladder10; ports A=A1 B2=B1 B=B1 C=C1 R1=NetK8_U_relay_ladder10_8 R2=NetK7_U_relay_ladder10_8 R3=NetK6_U_relay_ladder10_8 R4=NetK5_U_relay_ladder10_8 R5=NetK4_U_relay_ladder10_8 R6=NetK3_U_relay_ladder10_8 R7=NetK2_U_relay_ladder10_8 R8=NetK1_U_relay_ladder10_8 REL+=+12
U_relay_driver/U_relay_ladder: designators end in _U_relay_ladder9; ports A=A2 B2=B2 B=B2 C=C2 R1=NetK8_U_relay_ladder9_8 R2=NetK7_U_relay_ladder9_8 R3=NetK6_U_relay_ladder9_8 R4=NetK5_U_relay_ladder9_8 R5=NetK4_U_relay_ladder9_8 R6=NetK3_U_relay_ladder9_8 R7=NetK2_U_relay_ladder9_8 R8=NetK1_U_relay_ladder9_8 REL+=+12
U_relay_driver/U_relay_ladder: designators end in _U_relay_ladder8; ports A=A3 B2=B3 B=B3 C=C3 R1=NetK8_U_relay_ladder8_8 R2=NetK7_U_relay_ladder8_8 R3=NetK6_U_relay_ladder8_8 R4=NetK5_U_relay_ladder8_8 R5=NetK4_U_relay_ladder8_8 R6=NetK3_U_relay_ladder8_8 R7=NetK2_U_relay_ladder8_8 R8=NetK1_U_relay_ladder8_8 REL+=+12
U_relay_driver/U_relay_ladder: designators end in _U_relay_ladder7; ports A=A4 B2=B4 B=B4 C=C4 R1=NetK8_U_relay_ladder7_8 R2=NetK7_U_relay_ladder7_8 R3=NetK6_U_relay_ladder7_8 R4=NetK5_U_relay_ladder7_8 R5=NetK4_U_relay_ladder7_8 R6=NetK3_U_relay_ladder7_8 R7=NetK2_U_relay_ladder7_8 R8=NetK1_U_relay_ladder7_8 REL+=+12
U_relay_driver/U_relay_ladder: designators end in _U_relay_ladder6; ports A=A5 B2=B5 B=B5 C=C5 R1=NetK8_U_relay_ladder6_8 R2=NetK7_U_relay_ladder6_8 R3=NetK6_U_relay_ladder6_8 R4=NetK5_U_relay_ladder6_8 R5=NetK4_U_relay_ladder6_8 R6=NetK3_U_relay_ladder6_8 R7=NetK2_U_relay_ladder6_8 R8=NetK1_U_relay_ladder6_8 REL+=+12
U_relay_driver/U_relay_ladder: designators end in _U_relay_ladder5; ports A=A6 B2=B6 B=B6 C=C6 R1=NetK8_U_relay_ladder5_8 R2=NetK7_U_relay_ladder5_8 R3=NetK6_U_relay_ladder5_8 R4=NetK5_U_relay_ladder5_8 R5=NetK4_U_relay_ladder5_8 R6=NetK3_U_relay_ladder5_8 R7=NetK2_U_relay_ladder5_8 R8=NetK1_U_relay_ladder5_8 REL+=+12
U_relay_driver/U_relay_ladder: designators end in _U_relay_ladder4; ports A=A7 B2=B7 B=B7 C=C7 R1=NetK8_U_relay_ladder4_8 R2=NetK7_U_relay_ladder4_8 R3=NetK6_U_relay_ladder4_8 R4=NetK5_U_relay_ladder4_8 R5=NetK4_U_relay_ladder4_8 R6=NetK3_U_relay_ladder4_8 R7=NetK2_U_relay_ladder4_8 R8=NetK1_U_relay_ladder4_8 REL+=+12
U_relay_driver/U_relay_ladder: designators end in _U_relay_ladder3; ports A=A8 B2=B8 B=B8 C=C8 R1=NetK8_U_relay_ladder3_8 R2=NetK7_U_relay_ladder3_8 R3=NetK6_U_relay_ladder3_8 R4=NetK5_U_relay_ladder3_8 R5=NetK4_U_relay_ladder3_8 R6=NetK3_U_relay_ladder3_8 R7=NetK2_U_relay_ladder3_8 R8=NetK1_U_relay_ladder3_8 REL+=+12
U_relay_driver/U_relay_ladder: designators end in _U_relay_ladder2; ports A=A9 B2=B9 B=B9 C=C9 R1=NetK8_U_relay_ladder2_8 R2=NetK7_U_relay_ladder2_8 R3=NetK6_U_relay_ladder2_8 R4=NetK5_U_relay_ladder2_8 R5=NetK4_U_relay_ladder2_8 R6=NetK3_U_relay_ladder2_8 R7=NetK2_U_relay_ladder2_8 R8=NetK1_U_relay_ladder2_8 REL+=+12
U_relay_driver/U_relay_ladder: designators end in _U_relay_ladder1; ports A=A10 B2=B10 B=B10 C=C10 R1=NetK8_U_relay_ladder1_8 R2=NetK7_U_relay_ladder1_8 R3=NetK6_U_relay_ladder1_8 R4=NetK5_U_relay_ladder1_8 R5=NetK4_U_relay_ladder1_8 R6=NetK3_U_relay_ladder1_8 R7=NetK2_U_relay_ladder1_8 R8=NetK1_U_relay_ladder1_8 REL+=+12

### Library data of the parts
K1-K8 = IM-GR Relay DPDT: TE CONNECTIVITY  IM-GR  RELAY, DPDT, NO; Farnell ID: 1175070; URL: http://si.farnell.com/te-connectivity-axicom/im06gr/relay-gull-wing-dpco-12vdc-2a/dp/1175070
R5-R20 = R

## Nets that join several sheets
+3V3: MCU (7 pins), Power (C10.1 C11.1 LD1.5), relay_driver (20 pins)
+12: Power (5 pins), relay_driver (20 pins), U_relay_driver/U_relay_ladder (8 pins), U_relay_driver/U_relay_ladder (8 pins), U_relay_driver/U_relay_ladder (8 pins), U_relay_driver/U_relay_ladder (8 pins), U_relay_driver/U_relay_ladder (8 pins), U_relay_driver/U_relay_ladder (8 pins), U_relay_driver/U_relay_ladder (8 pins), U_relay_driver/U_relay_ladder (8 pins), U_relay_driver/U_relay_ladder (8 pins), U_relay_driver/U_relay_ladder (8 pins)
GND: MCU (11 pins), Power (11 pins), relay_driver (31 pins)
VCC 5V: MCU (B2.10 C2.1), Power (7 pins)
A1: relay_driver (P3.3), U_relay_driver/U_relay_ladder (K1_U_relay_ladder10.6 R13_U_relay_ladder10.1)
A2: relay_driver (P3.7), U_relay_driver/U_relay_ladder (K1_U_relay_ladder9.6 R13_U_relay_ladder9.1)
A3: relay_driver (P3.11), U_relay_driver/U_relay_ladder (K1_U_relay_ladder8.6 R13_U_relay_ladder8.1)
A4: relay_driver (P3.15), U_relay_driver/U_relay_ladder (K1_U_relay_ladder7.6 R13_U_relay_ladder7.1)
A5: relay_driver (P3.19), U_relay_driver/U_relay_ladder (K1_U_relay_ladder6.6 R13_U_relay_ladder6.1)
A6: relay_driver (P6.17), U_relay_driver/U_relay_ladder (K1_U_relay_ladder5.6 R13_U_relay_ladder5.1)
A7: relay_driver (P6.13), U_relay_driver/U_relay_ladder (K1_U_relay_ladder4.6 R13_U_relay_ladder4.1)
A8: relay_driver (P6.9), U_relay_driver/U_relay_ladder (K1_U_relay_ladder3.6 R13_U_relay_ladder3.1)
A9: relay_driver (P6.5), U_relay_driver/U_relay_ladder (K1_U_relay_ladder2.6 R13_U_relay_ladder2.1)
A10: relay_driver (P6.1), U_relay_driver/U_relay_ladder (K1_U_relay_ladder1.6 R13_U_relay_ladder1.1)
B1: relay_driver (P3.2 TP1.1), U_relay_driver/U_relay_ladder (6 pins)
B2: relay_driver (P3.6 TP2.1), U_relay_driver/U_relay_ladder (6 pins)
B3: relay_driver (P3.10 TP3.1), U_relay_driver/U_relay_ladder (6 pins)
B4: relay_driver (P3.14 TP4.1), U_relay_driver/U_relay_ladder (6 pins)
B5: relay_driver (P3.18 TP5.1), U_relay_driver/U_relay_ladder (6 pins)
B6: relay_driver (P6.18 TP6.1), U_relay_driver/U_relay_ladder (6 pins)
B7: relay_driver (P6.14 TP7.1), U_relay_driver/U_relay_ladder (6 pins)
B8: relay_driver (P6.10 TP8.1), U_relay_driver/U_relay_ladder (6 pins)
B9: relay_driver (P6.6 TP9.1), U_relay_driver/U_relay_ladder (6 pins)
B10: relay_driver (P6.2 TP10.1), U_relay_driver/U_relay_ladder (6 pins)
C1: relay_driver (P3.1), U_relay_driver/U_relay_ladder (K1_U_relay_ladder10.4 R5_U_relay_ladder10.1)
C2: relay_driver (P3.5), U_relay_driver/U_relay_ladder (K1_U_relay_ladder9.4 R5_U_relay_ladder9.1)
C3: relay_driver (P3.9), U_relay_driver/U_relay_ladder (K1_U_relay_ladder8.4 R5_U_relay_ladder8.1)
C4: relay_driver (P3.13), U_relay_driver/U_relay_ladder (K1_U_relay_ladder7.4 R5_U_relay_ladder7.1)
C5: relay_driver (P3.17), U_relay_driver/U_relay_ladder (K1_U_relay_ladder6.4 R5_U_relay_ladder6.1)
C6: relay_driver (P6.19), U_relay_driver/U_relay_ladder (K1_U_relay_ladder5.4 R5_U_relay_ladder5.1)
C7: relay_driver (P6.15), U_relay_driver/U_relay_ladder (K1_U_relay_ladder4.4 R5_U_relay_ladder4.1)
C8: relay_driver (P6.11), U_relay_driver/U_relay_ladder (K1_U_relay_ladder3.4 R5_U_relay_ladder3.1)
C9: relay_driver (P6.7), U_relay_driver/U_relay_ladder (K1_U_relay_ladder2.4 R5_U_relay_ladder2.1)
C10: relay_driver (P6.3), U_relay_driver/U_relay_ladder (K1_U_relay_ladder1.4 R5_U_relay_ladder1.1)
NetK1_U_relay_ladder1_8: relay_driver (ULN10.17), U_relay_driver/U_relay_ladder (K1_U_relay_ladder1.8)
NetK1_U_relay_ladder2_8: relay_driver (ULN9.17), U_relay_driver/U_relay_ladder (K1_U_relay_ladder2.8)
NetK1_U_relay_ladder3_8: relay_driver (ULN8.17), U_relay_driver/U_relay_ladder (K1_U_relay_ladder3.8)
NetK1_U_relay_ladder4_8: relay_driver (ULN7.17), U_relay_driver/U_relay_ladder (K1_U_relay_ladder4.8)
NetK1_U_relay_ladder5_8: relay_driver (ULN6.17), U_relay_driver/U_relay_ladder (K1_U_relay_ladder5.8)
NetK1_U_relay_ladder6_8: relay_driver (ULN5.10), U_relay_driver/U_relay_ladder (K1_U_relay_ladder6.8)
NetK1_U_relay_ladder7_8: relay_driver (ULN4.10), U_relay_driver/U_relay_ladder (K1_U_relay_ladder7.8)
NetK1_U_relay_ladder8_8: relay_driver (ULN3.10), U_relay_driver/U_relay_ladder (K1_U_relay_ladder8.8)
NetK1_U_relay_ladder9_8: relay_driver (ULN2.10), U_relay_driver/U_relay_ladder (K1_U_relay_ladder9.8)
NetK1_U_relay_ladder10_8: relay_driver (ULN1.10), U_relay_driver/U_relay_ladder (K1_U_relay_ladder10.8)
NetK2_U_relay_ladder1_8: relay_driver (ULN10.16), U_relay_driver/U_relay_ladder (K2_U_relay_ladder1.8)
NetK2_U_relay_ladder2_8: relay_driver (ULN9.16), U_relay_driver/U_relay_ladder (K2_U_relay_ladder2.8)
NetK2_U_relay_ladder3_8: relay_driver (ULN8.16), U_relay_driver/U_relay_ladder (K2_U_relay_ladder3.8)
NetK2_U_relay_ladder4_8: relay_driver (ULN7.16), U_relay_driver/U_relay_ladder (K2_U_relay_ladder4.8)
NetK2_U_relay_ladder5_8: relay_driver (ULN6.16), U_relay_driver/U_relay_ladder (K2_U_relay_ladder5.8)
NetK2_U_relay_ladder6_8: relay_driver (ULN5.11), U_relay_driver/U_relay_ladder (K2_U_relay_ladder6.8)
NetK2_U_relay_ladder7_8: relay_driver (ULN4.11), U_relay_driver/U_relay_ladder (K2_U_relay_ladder7.8)
NetK2_U_relay_ladder8_8: relay_driver (ULN3.11), U_relay_driver/U_relay_ladder (K2_U_relay_ladder8.8)
NetK2_U_relay_ladder9_8: relay_driver (ULN2.11), U_relay_driver/U_relay_ladder (K2_U_relay_ladder9.8)
NetK2_U_relay_ladder10_8: relay_driver (ULN1.11), U_relay_driver/U_relay_ladder (K2_U_relay_ladder10.8)
NetK3_U_relay_ladder1_8: relay_driver (ULN10.15), U_relay_driver/U_relay_ladder (K3_U_relay_ladder1.8)
NetK3_U_relay_ladder2_8: relay_driver (ULN9.15), U_relay_driver/U_relay_ladder (K3_U_relay_ladder2.8)
NetK3_U_relay_ladder3_8: relay_driver (ULN8.15), U_relay_driver/U_relay_ladder (K3_U_relay_ladder3.8)
NetK3_U_relay_ladder4_8: relay_driver (ULN7.15), U_relay_driver/U_relay_ladder (K3_U_relay_ladder4.8)
NetK3_U_relay_ladder5_8: relay_driver (ULN6.15), U_relay_driver/U_relay_ladder (K3_U_relay_ladder5.8)
NetK3_U_relay_ladder6_8: relay_driver (ULN5.12), U_relay_driver/U_relay_ladder (K3_U_relay_ladder6.8)
NetK3_U_relay_ladder7_8: relay_driver (ULN4.12), U_relay_driver/U_relay_ladder (K3_U_relay_ladder7.8)
NetK3_U_relay_ladder8_8: relay_driver (ULN3.12), U_relay_driver/U_relay_ladder (K3_U_relay_ladder8.8)
NetK3_U_relay_ladder9_8: relay_driver (ULN2.12), U_relay_driver/U_relay_ladder (K3_U_relay_ladder9.8)
NetK3_U_relay_ladder10_8: relay_driver (ULN1.12), U_relay_driver/U_relay_ladder (K3_U_relay_ladder10.8)
NetK4_U_relay_ladder1_8: relay_driver (ULN10.14), U_relay_driver/U_relay_ladder (K4_U_relay_ladder1.8)
NetK4_U_relay_ladder2_8: relay_driver (ULN9.14), U_relay_driver/U_relay_ladder (K4_U_relay_ladder2.8)
NetK4_U_relay_ladder3_8: relay_driver (ULN8.14), U_relay_driver/U_relay_ladder (K4_U_relay_ladder3.8)
NetK4_U_relay_ladder4_8: relay_driver (ULN7.14), U_relay_driver/U_relay_ladder (K4_U_relay_ladder4.8)
NetK4_U_relay_ladder5_8: relay_driver (ULN6.14), U_relay_driver/U_relay_ladder (K4_U_relay_ladder5.8)
NetK4_U_relay_ladder6_8: relay_driver (ULN5.13), U_relay_driver/U_relay_ladder (K4_U_relay_ladder6.8)
NetK4_U_relay_ladder7_8: relay_driver (ULN4.13), U_relay_driver/U_relay_ladder (K4_U_relay_ladder7.8)
NetK4_U_relay_ladder8_8: relay_driver (ULN3.13), U_relay_driver/U_relay_ladder (K4_U_relay_ladder8.8)
NetK4_U_relay_ladder9_8: relay_driver (ULN2.13), U_relay_driver/U_relay_ladder (K4_U_relay_ladder9.8)
NetK4_U_relay_ladder10_8: relay_driver (ULN1.13), U_relay_driver/U_relay_ladder (K4_U_relay_ladder10.8)
NetK5_U_relay_ladder1_8: relay_driver (ULN10.13), U_relay_driver/U_relay_ladder (K5_U_relay_ladder1.8)
NetK5_U_relay_ladder2_8: relay_driver (ULN9.13), U_relay_driver/U_relay_ladder (K5_U_relay_ladder2.8)
NetK5_U_relay_ladder3_8: relay_driver (ULN8.13), U_relay_driver/U_relay_ladder (K5_U_relay_ladder3.8)
NetK5_U_relay_ladder4_8: relay_driver (ULN7.13), U_relay_driver/U_relay_ladder (K5_U_relay_ladder4.8)
NetK5_U_relay_ladder5_8: relay_driver (ULN6.13), U_relay_driver/U_relay_ladder (K5_U_relay_ladder5.8)
NetK5_U_relay_ladder6_8: relay_driver (ULN5.14), U_relay_driver/U_relay_ladder (K5_U_relay_ladder6.8)
NetK5_U_relay_ladder7_8: relay_driver (ULN4.14), U_relay_driver/U_relay_ladder (K5_U_relay_ladder7.8)
NetK5_U_relay_ladder8_8: relay_driver (ULN3.14), U_relay_driver/U_relay_ladder (K5_U_relay_ladder8.8)
NetK5_U_relay_ladder9_8: relay_driver (ULN2.14), U_relay_driver/U_relay_ladder (K5_U_relay_ladder9.8)
NetK5_U_relay_ladder10_8: relay_driver (ULN1.14), U_relay_driver/U_relay_ladder (K5_U_relay_ladder10.8)
NetK6_U_relay_ladder1_8: relay_driver (ULN10.12), U_relay_driver/U_relay_ladder (K6_U_relay_ladder1.8)
NetK6_U_relay_ladder2_8: relay_driver (ULN9.12), U_relay_driver/U_relay_ladder (K6_U_relay_ladder2.8)
NetK6_U_relay_ladder3_8: relay_driver (ULN8.12), U_relay_driver/U_relay_ladder (K6_U_relay_ladder3.8)
NetK6_U_relay_ladder4_8: relay_driver (ULN7.12), U_relay_driver/U_relay_ladder (K6_U_relay_ladder4.8)
NetK6_U_relay_ladder5_8: relay_driver (ULN6.12), U_relay_driver/U_relay_ladder (K6_U_relay_ladder5.8)
NetK6_U_relay_ladder6_8: relay_driver (ULN5.15), U_relay_driver/U_relay_ladder (K6_U_relay_ladder6.8)
NetK6_U_relay_ladder7_8: relay_driver (ULN4.15), U_relay_driver/U_relay_ladder (K6_U_relay_ladder7.8)
NetK6_U_relay_ladder8_8: relay_driver (ULN3.15), U_relay_driver/U_relay_ladder (K6_U_relay_ladder8.8)
NetK6_U_relay_ladder9_8: relay_driver (ULN2.15), U_relay_driver/U_relay_ladder (K6_U_relay_ladder9.8)
NetK6_U_relay_ladder10_8: relay_driver (ULN1.15), U_relay_driver/U_relay_ladder (K6_U_relay_ladder10.8)
NetK7_U_relay_ladder1_8: relay_driver (ULN10.11), U_relay_driver/U_relay_ladder (K7_U_relay_ladder1.8)
NetK7_U_relay_ladder2_8: relay_driver (ULN9.11), U_relay_driver/U_relay_ladder (K7_U_relay_ladder2.8)
NetK7_U_relay_ladder3_8: relay_driver (ULN8.11), U_relay_driver/U_relay_ladder (K7_U_relay_ladder3.8)
NetK7_U_relay_ladder4_8: relay_driver (ULN7.11), U_relay_driver/U_relay_ladder (K7_U_relay_ladder4.8)
NetK7_U_relay_ladder5_8: relay_driver (ULN6.11), U_relay_driver/U_relay_ladder (K7_U_relay_ladder5.8)
NetK7_U_relay_ladder6_8: relay_driver (ULN5.16), U_relay_driver/U_relay_ladder (K7_U_relay_ladder6.8)
NetK7_U_relay_ladder7_8: relay_driver (ULN4.16), U_relay_driver/U_relay_ladder (K7_U_relay_ladder7.8)
NetK7_U_relay_ladder8_8: relay_driver (ULN3.16), U_relay_driver/U_relay_ladder (K7_U_relay_ladder8.8)
NetK7_U_relay_ladder9_8: relay_driver (ULN2.16), U_relay_driver/U_relay_ladder (K7_U_relay_ladder9.8)
NetK7_U_relay_ladder10_8: relay_driver (ULN1.16), U_relay_driver/U_relay_ladder (K7_U_relay_ladder10.8)
NetK8_U_relay_ladder1_8: relay_driver (ULN10.10), U_relay_driver/U_relay_ladder (K8_U_relay_ladder1.8)
NetK8_U_relay_ladder2_8: relay_driver (ULN9.10), U_relay_driver/U_relay_ladder (K8_U_relay_ladder2.8)
NetK8_U_relay_ladder3_8: relay_driver (ULN8.10), U_relay_driver/U_relay_ladder (K8_U_relay_ladder3.8)
NetK8_U_relay_ladder4_8: relay_driver (ULN7.10), U_relay_driver/U_relay_ladder (K8_U_relay_ladder4.8)
NetK8_U_relay_ladder5_8: relay_driver (ULN6.10), U_relay_driver/U_relay_ladder (K8_U_relay_ladder5.8)
NetK8_U_relay_ladder6_8: relay_driver (ULN5.17), U_relay_driver/U_relay_ladder (K8_U_relay_ladder6.8)
NetK8_U_relay_ladder7_8: relay_driver (ULN4.17), U_relay_driver/U_relay_ladder (K8_U_relay_ladder7.8)
NetK8_U_relay_ladder8_8: relay_driver (ULN3.17), U_relay_driver/U_relay_ladder (K8_U_relay_ladder8.8)
NetK8_U_relay_ladder9_8: relay_driver (ULN2.17), U_relay_driver/U_relay_ladder (K8_U_relay_ladder9.8)
NetK8_U_relay_ladder10_8: relay_driver (ULN1.17), U_relay_driver/U_relay_ladder (K8_U_relay_ladder10.8)
SCL_DRV: MCU (B1.1 R1.2), relay_driver (5 pins)
SDA_DRV: MCU (B1.28 R2.2), relay_driver (5 pins)